# Altium schematic sheet USBCONN_MICROAB_BM.SchDoc
size A3; SheetNumber: 16; SheetTotal: 22
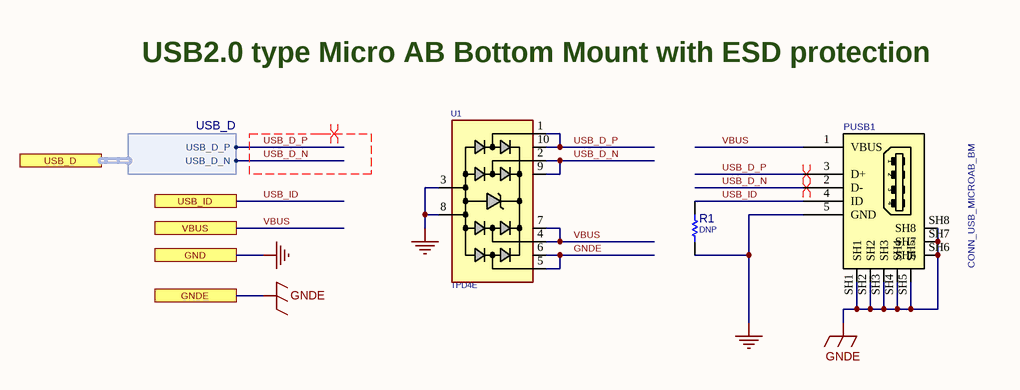
[diagram p0: USBCONN_MICROAB_BM.SchDoc]

## Parts
PUSB1  CONN_USB_MICROAB_BM  [USB_MICRO_AB_BM_SHT]
R1  DNP  [R0402]
U1  TPD4E  [SON50_10_2510]

## Ports
GND, GNDE, USB_D (harness USB_D), USB_ID, VBUS

## Harnesses
USB_D: USB_D_P, USB_D_N

## Nets
GND: PUSB1.5(GND) R1.1 U1.3 U1.8 ; port GND
GNDE: PUSB1.SH1 PUSB1.SH2 PUSB1.SH3 PUSB1.SH4 PUSB1.SH5 PUSB1.SH6 PUSB1.SH7 PUSB1.SH8 U1.5 U1.6 ; port GNDE
USB_D_N: PUSB1.2(D-) U1.2 U1.9 ; port USB_D.USB_D_N
USB_D_P: PUSB1.3(D+) U1.1 U1.10 ; port USB_D.USB_D_P
USB_ID: PUSB1.4(ID) R1.2 ; port USB_ID
VBUS: PUSB1.1(VBUS) U1.4 U1.7 ; port VBUS

## Layout directives
differential pair: USB_D_N, USB_D_P

## Notes on the sheet
- USB2.0 type Micro AB Bottom Mount with ESD protection

## Library data of the parts
PUSB1 = CONN_USB_MICRO_AB_BM_SHT: CONN, USB, MICRO AB, R/A, SMD, BOTTOM MOUNT; MANF_P#: 47589-0001; MANF: MOLEX; PARAM2: 30VAC; PARAM: 1.8A, -20~85oC; MANF_P#2: HIROSE ZX62D-AB-5P8; PRICE: 0.75$; VALUE: CONN_USB_MICROAB_BM
R1 = RES_SMD: RESISTOR, SMD; PARAM: 0.063W; DESC: DESCRIPTION; DIST#: MOUSER; PARAM2: 1%; MANF_P#: -; MANF: -; ASSEMBLY: ASSEMBLY; PRICE: 100= 0.5$; VALUE: DNP
U1 = TVS_X4_TPD4E05U06: TVS, ESD PROTECT, 4CH,; MANF_P#: TPD4E05U06DQA; MANF: Texas Instruments; PARAM2: 6.5Vbr, 0.4pF, –40°~125°C; PARAM: ±12-kV ContactD, ±15-kVAirD; PRICE: 0.6$; VALUE: TPD4E